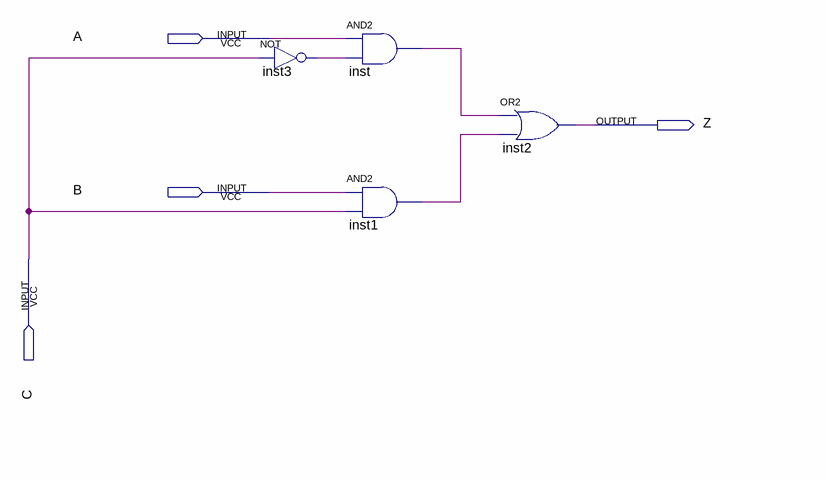
[diagram p0: schematic sheet]
// Quartus schematic MUX2x1.bdf as structural Verilog: 4 symbols, 4 pins
module MUX2x1 (
  input  A,
  input  B,
  input  C,
  output Z
);

  wire inst1_out, inst3_out, inst_out;

  not inst3 (inst3_out, C);
  and inst (inst_out, A, inst3_out);
  and inst1 (inst1_out, B, C);
  or inst2 (Z, inst_out, inst1_out);
endmodule
